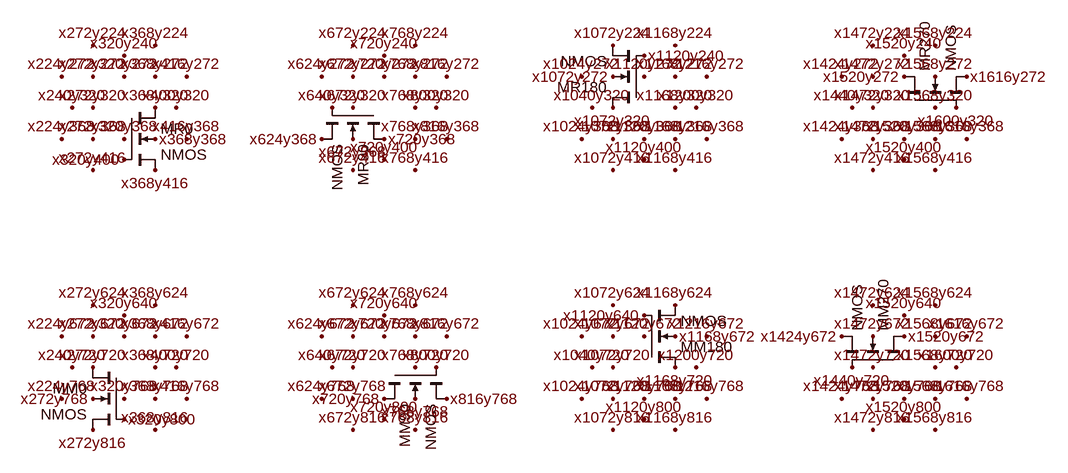
[diagram p0: schematic orientation_nmos4.asc]
orientation_nmos4.asc, the LTspice schematic file:
Version 4
SHEET 1 2000 1200
FLAG 272 320 x272y320
FLAG 320 272 x320y272
FLAG 320 368 x320y368
FLAG 368 320 x368y320
FLAG 240 320 x240y320
FLAG 320 240 x320y240
FLAG 320 400 x320y400
FLAG 400 320 x400y320
FLAG 224 272 x224y272
FLAG 224 368 x224y368
FLAG 272 224 x272y224
FLAG 272 416 x272y416
FLAG 368 224 x368y224
FLAG 368 416 x368y416
FLAG 416 272 x416y272
FLAG 416 368 x416y368
FLAG 272 272 x272y272
FLAG 272 368 x272y368
FLAG 368 272 x368y272
FLAG 368 368 x368y368
FLAG 672 320 x672y320
FLAG 720 272 x720y272
FLAG 720 368 x720y368
FLAG 768 320 x768y320
FLAG 640 320 x640y320
FLAG 720 240 x720y240
FLAG 720 400 x720y400
FLAG 800 320 x800y320
FLAG 624 272 x624y272
FLAG 624 368 x624y368
FLAG 672 224 x672y224
FLAG 672 416 x672y416
FLAG 768 224 x768y224
FLAG 768 416 x768y416
FLAG 816 272 x816y272
FLAG 816 368 x816y368
FLAG 672 272 x672y272
FLAG 672 368 x672y368
FLAG 768 272 x768y272
FLAG 768 368 x768y368
FLAG 1072 320 x1072y320
FLAG 1120 272 x1120y272
FLAG 1120 368 x1120y368
FLAG 1168 320 x1168y320
FLAG 1040 320 x1040y320
FLAG 1120 240 x1120y240
FLAG 1120 400 x1120y400
FLAG 1200 320 x1200y320
FLAG 1024 272 x1024y272
FLAG 1024 368 x1024y368
FLAG 1072 224 x1072y224
FLAG 1072 416 x1072y416
FLAG 1168 224 x1168y224
FLAG 1168 416 x1168y416
FLAG 1216 272 x1216y272
FLAG 1216 368 x1216y368
FLAG 1072 272 x1072y272
FLAG 1072 368 x1072y368
FLAG 1168 272 x1168y272
FLAG 1168 368 x1168y368
FLAG 1472 320 x1472y320
FLAG 1520 272 x1520y272
FLAG 1520 368 x1520y368
FLAG 1568 320 x1568y320
FLAG 1440 320 x1440y320
FLAG 1520 240 x1520y240
FLAG 1520 400 x1520y400
FLAG 1600 320 x1600y320
FLAG 1424 272 x1424y272
FLAG 1424 368 x1424y368
FLAG 1472 224 x1472y224
FLAG 1472 416 x1472y416
FLAG 1568 224 x1568y224
FLAG 1568 416 x1568y416
FLAG 1616 272 x1616y272
FLAG 1616 368 x1616y368
FLAG 1472 272 x1472y272
FLAG 1472 368 x1472y368
FLAG 1568 272 x1568y272
FLAG 1568 368 x1568y368
FLAG 272 720 x272y720
FLAG 320 672 x320y672
FLAG 320 768 x320y768
FLAG 368 720 x368y720
FLAG 240 720 x240y720
FLAG 320 640 x320y640
FLAG 320 800 x320y800
FLAG 400 720 x400y720
FLAG 224 672 x224y672
FLAG 224 768 x224y768
FLAG 272 624 x272y624
FLAG 272 816 x272y816
FLAG 368 624 x368y624
FLAG 368 816 x368y816
FLAG 416 672 x416y672
FLAG 416 768 x416y768
FLAG 272 672 x272y672
FLAG 272 768 x272y768
FLAG 368 672 x368y672
FLAG 368 768 x368y768
FLAG 672 720 x672y720
FLAG 720 672 x720y672
FLAG 720 768 x720y768
FLAG 768 720 x768y720
FLAG 640 720 x640y720
FLAG 720 640 x720y640
FLAG 720 800 x720y800
FLAG 800 720 x800y720
FLAG 624 672 x624y672
FLAG 624 768 x624y768
FLAG 672 624 x672y624
FLAG 672 816 x672y816
FLAG 768 624 x768y624
FLAG 768 816 x768y816
FLAG 816 672 x816y672
FLAG 816 768 x816y768
FLAG 672 672 x672y672
FLAG 672 768 x672y768
FLAG 768 672 x768y672
FLAG 768 768 x768y768
FLAG 1072 720 x1072y720
FLAG 1120 672 x1120y672
FLAG 1120 768 x1120y768
FLAG 1168 720 x1168y720
FLAG 1040 720 x1040y720
FLAG 1120 640 x1120y640
FLAG 1120 800 x1120y800
FLAG 1200 720 x1200y720
FLAG 1024 672 x1024y672
FLAG 1024 768 x1024y768
FLAG 1072 624 x1072y624
FLAG 1072 816 x1072y816
FLAG 1168 624 x1168y624
FLAG 1168 816 x1168y816
FLAG 1216 672 x1216y672
FLAG 1216 768 x1216y768
FLAG 1072 672 x1072y672
FLAG 1072 768 x1072y768
FLAG 1168 672 x1168y672
FLAG 1168 768 x1168y768
FLAG 1472 720 x1472y720
FLAG 1520 672 x1520y672
FLAG 1520 768 x1520y768
FLAG 1568 720 x1568y720
FLAG 1440 720 x1440y720
FLAG 1520 640 x1520y640
FLAG 1520 800 x1520y800
FLAG 1600 720 x1600y720
FLAG 1424 672 x1424y672
FLAG 1424 768 x1424y768
FLAG 1472 624 x1472y624
FLAG 1472 816 x1472y816
FLAG 1568 624 x1568y624
FLAG 1568 816 x1568y816
FLAG 1616 672 x1616y672
FLAG 1616 768 x1616y768
FLAG 1472 672 x1472y672
FLAG 1472 768 x1472y768
FLAG 1568 672 x1568y672
FLAG 1568 768 x1568y768
SYMBOL nmos4 320 320 R0
SYMATTR InstName MR0
SYMBOL nmos4 720 320 R90
SYMATTR InstName MR90
SYMBOL nmos4 1120 320 R180
SYMATTR InstName MR180
SYMBOL nmos4 1520 320 R270
SYMATTR InstName MR270
SYMBOL nmos4 320 720 M0
SYMATTR InstName MM0
SYMBOL nmos4 720 720 M90
SYMATTR InstName MM90
SYMBOL nmos4 1120 720 M180
SYMATTR InstName MM180
SYMBOL nmos4 1520 720 M270
SYMATTR InstName MM270

The netlist it stands for:
* orientation_nmos4.asc
MR0 x368y320 x320y400 x368y416 x368y368 NMOS
MR90 x720y368 x640y320 x624y368 x672y368 NMOS
MR180 x1072y320 x1120y240 x1072y224 x1072y272 NMOS
MR270 x1520y272 x1600y320 x1616y272 x1568y272 NMOS
MM0 x272y720 x320y800 x272y816 x272y768 NMOS
MM90 x720y768 x800y720 x816y768 x768y768 NMOS
MM180 x1168y720 x1120y640 x1168y624 x1168y672 NMOS
MM270 x1520y672 x1440y720 x1424y672 x1472y672 NMOS
.model NMOS NMOS
.model PMOS PMOS
.lib standard.mos
.backanno
.end